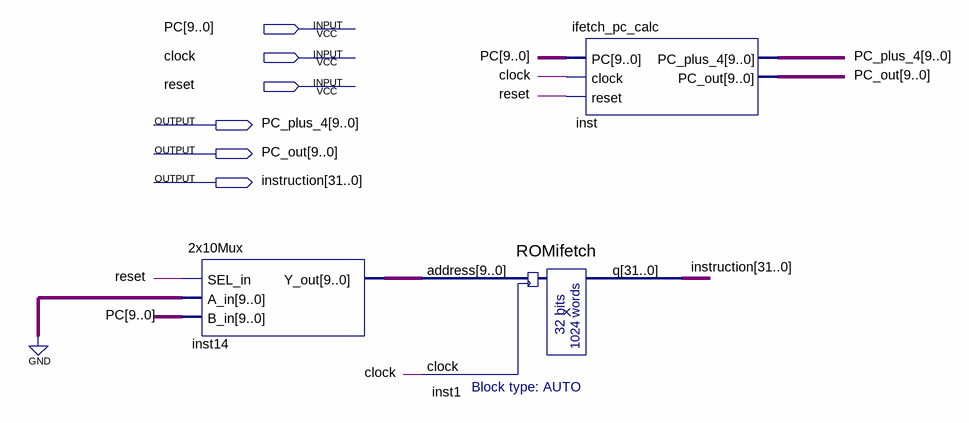
[diagram p0: schematic sheet]
// Quartus schematic ifetchROM.bdf as structural Verilog: 3 symbols, 6 pins
module ifetchROM (
  input  [9:0] PC,
  input  clock,
  input  reset,
  output [9:0] PC_plus_4,
  output [9:0] PC_out,
  output [31:0] instruction
);

  wire [9:0] inst14_y_out;

  \2x10Mux  inst14 (.SEL_in(reset), .A_in({10{1'b0}}), .B_in(PC), .Y_out(inst14_y_out));
  ROMifetch inst1 (.address(inst14_y_out), .clock(clock), .q(instruction));
  ifetch_pc_calc inst (.PC(PC), .clock(clock), .reset(reset), .PC_plus_4(PC_plus_4), .PC_out(PC_out));
endmodule
